# Altium schematic sheet Core.SchDoc
size A4
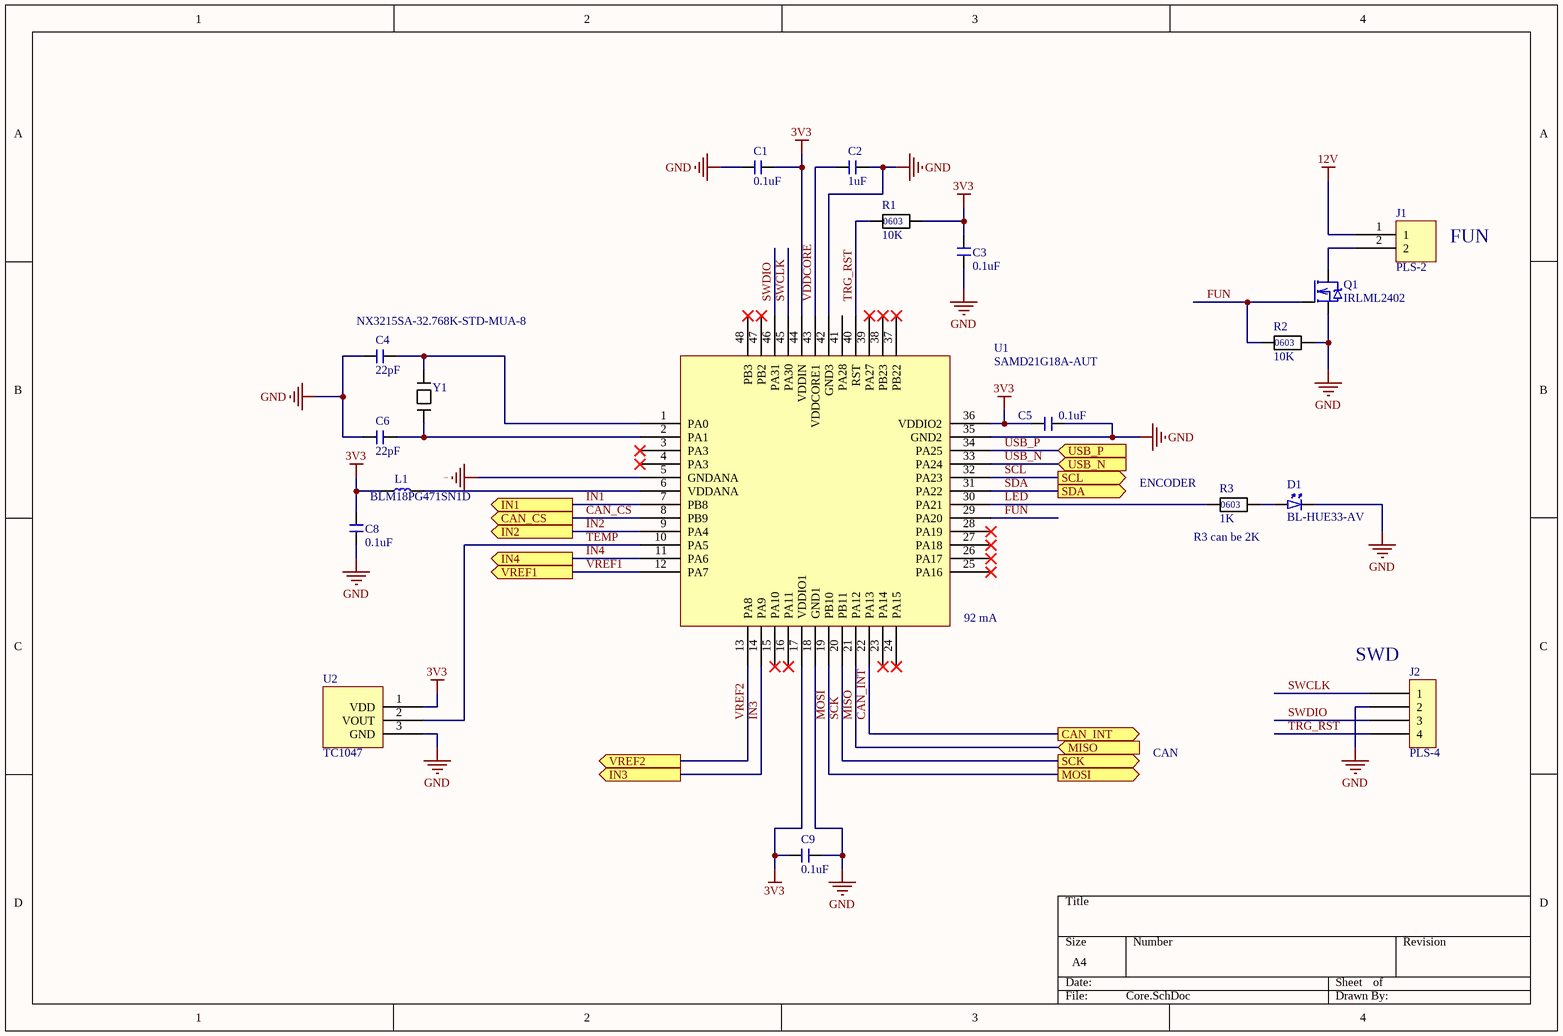
[diagram p0: Core.SchDoc]

## Parts
C1  0.1uF  [CHIP_C_0603]
C2  1uF  [CHIP_C_0603]
C3  0.1uF  [CHIP_C_0603]
C4  22pF  [CHIP_C_0603]
C5  0.1uF  [CHIP_C_0603]
C6  22pF  [CHIP_C_0603]
C8  0.1uF  [CHIP_C_0603]
C9  0.1uF  [CHIP_C_0603]
D1  BL-HUE33-AV  [CHIP_D_0603]
J1  PLS-2  [PLS-2]
J2  PLS-4  [PLS-4]
L1  BLM18PG471SN1D  [CHIP_R_0603]
Q1  IRLML2402  [SOT23]
R1  10K  [CHIP_R_0603]
R2  10K  [CHIP_R_0603]
R3  1K  [CHIP_R_0603]
U1  SAMD21G18A-AUT  [LQFP48]
U2  TC1047  [SOT23]
Y1  NX3215SA-32.768K-STD-MUA-8  [NX3215SA]

## Ports
CAN_CS (out), CAN_INT (out), IN1 (out), IN2 (out), IN3 (out), IN4 (out), MISO (in), MOSI (out), SCK (out), SCL (out), SDA (out), USB_N (in), USB_P (in), VREF1 (out), VREF2 (out)

## Nets
3V3: C1.2 C3.2 C5.1 C8.2 C9.1 L1.1 R1.2 U1.17(VDDIO1) U1.36(VDDIO2) U1.44(VDDIN) U2.1(VDD)
12V: J1.1
GND: C1.1 C2.2 C3.1 C4.1 C5.2 C6.1 C8.1 C9.2 D1.2(C) J2.2 Q1.2(S) R2.2 U1.5(GNDANA) U1.18(GND1) U1.35(GND2) U1.42(GND3) U2.3(GND)
CAN_CS: U1.8(PB9) ; port CAN_CS
CAN_INT: U1.22(PA13) ; port CAN_INT
FUN: Q1.1(G) R2.1 U1.29(PA20)
IN1: U1.7(PB8) ; port IN1
IN2: U1.9(PA4) ; port IN2
IN3: U1.14(PA9) ; port IN3
IN4: U1.11(PA6) ; port IN4
LED: R3.1 U1.30(PA21)
MISO: U1.21(PA12) ; port MISO
MOSI: U1.19(PB10) ; port MOSI
SCK: U1.20(PB11) ; port SCK
SCL: U1.32(PA23) ; port SCL
SDA: U1.31(PA22) ; port SDA
SWCLK: J2.1 U1.45(PA30)
SWDIO: J2.3 U1.46(PA31)
TEMP: U1.10(PA5) U2.2(VOUT)
TRG_RST: J2.4 R1.1 U1.40(RST)
USB_N: U1.33(PA24) ; port USB_N
USB_P: U1.34(PA25) ; port USB_P
VDDCORE: C2.1 U1.43(VDDCORE1)
VREF1: U1.12(PA7) ; port VREF1
VREF2: U1.13(PA8) ; port VREF2
NetC4_2: C4.2 U1.1(PA0) Y1.2
NetC6_2: C6.2 U1.2(PA1) Y1.1
NetD1_1: D1.1(A) R3.2
NetJ1_2: J1.2 Q1.3(D)
NetL1_2: L1.2 U1.6(VDDANA)

Not connected (* = marked no-connect by the designer): U1 3(PA3)* 4(PA3)* 15(PA10)* 16(PA11)* 23(PA14)* 24(PA15)* 25(PA16)* 26(PA17)* 27(PA18)* 28(PA19)* 37(PB22)* 38(PB23)* 39(PA27)* 41(PA28) 47(PB2)* 48(PB3)*

## Notes on the sheet
- FUN
- (near R3) ENCODER
- R3 can be 2K
- (near U1) 92 mA
- (near J2) SWD
- CAN
- (in symbol RES_0603) 0603

## Library data of the parts
C1-C6 C8 C9 = CHIP_C
D1 = KP-3216: LED
J1 = PLS-2: Connector
L1 = BLM
Q1 = IRLML2402: n-chanal MOSFET
R1-R3 = RES_0603
U2 = TC1047: Temperature Sensor
Y1 = Quartz